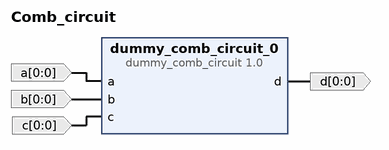
[diagram p0: block diagram of the top level]
# Vivado block design Comb_circuit, xc7a35tcpg236-1, Vivado 2025.1
create_bd_design Comb_circuit

create_bd_port -dir I -from 0 -to 0 -type data a
create_bd_port -dir I -from 0 -to 0 -type data b
create_bd_port -dir O -from 0 -to 0 -type data d
create_bd_port -dir I -from 0 -to 0 -type data c

create_bd_cell -type ip -vlnv xilinx.com:hls:dummy_comb_circuit:1.0 dummy_comb_circuit_0

# ---- connections ----

connect_bd_net -net a_0_1 [get_bd_ports a] [get_bd_pins dummy_comb_circuit_0/a]
connect_bd_net -net b_0_1 [get_bd_ports b] [get_bd_pins dummy_comb_circuit_0/b]
connect_bd_net -net c_0_1 [get_bd_ports c] [get_bd_pins dummy_comb_circuit_0/c]
connect_bd_net [get_bd_pins dummy_comb_circuit_0/d] [get_bd_ports d]

validate_bd_design
save_bd_design
